# Vivado block design design_1, xczu28dr-ffvg1517-2-e, Vivado 2021.1
# (continued, part 4 of 9)
current_bd_instance /chan4/GPIO

create_bd_cell -type ip -vlnv xilinx.com:ip:xlslice:1.0 xlslice_mix_dp
set_property -dict {CONFIG.DIN_FROM 21 CONFIG.DIN_TO 0 CONFIG.DOUT_WIDTH 22} [get_bd_cells xlslice_mix_dp]
create_bd_cell -type ip -vlnv xilinx.com:ip:xlslice:1.0 xlslice_beat_we0
set_property -dict {CONFIG.DIN_FROM 0 CONFIG.DIN_TO 0 CONFIG.DOUT_WIDTH 1} [get_bd_cells xlslice_beat_we0]
create_bd_cell -type ip -vlnv xilinx.com:ip:xlslice:1.0 we_odd_9
set_property -dict {CONFIG.DIN_FROM 11 CONFIG.DIN_TO 0 CONFIG.DOUT_WIDTH 12} [get_bd_cells we_odd_9]
create_bd_cell -type ip -vlnv xilinx.com:ip:xlslice:1.0 we_even_1
set_property -dict {CONFIG.DIN_FROM 0 CONFIG.DOUT_WIDTH 1} [get_bd_cells we_even_1]
create_bd_cell -type ip -vlnv xilinx.com:ip:axi_gpio:2.0 axi_gpio_6
set_property -dict {CONFIG.C_ALL_OUTPUTS 1 CONFIG.C_ALL_OUTPUTS_2 1 CONFIG.C_IS_DUAL 1} [get_bd_cells axi_gpio_6]
create_bd_cell -type ip -vlnv xilinx.com:ip:xlslice:1.0 xlslice_getAccumChan
set_property -dict {CONFIG.DIN_FROM 31 CONFIG.DIN_TO 23 CONFIG.DOUT_WIDTH 9} [get_bd_cells xlslice_getAccumChan]
create_bd_cell -type ip -vlnv xilinx.com:ip:axi_gpio:2.0 axi_gpio_7
set_property -dict {CONFIG.C_ALL_OUTPUTS 1 CONFIG.C_ALL_OUTPUTS_2 1 CONFIG.C_IS_DUAL 1} [get_bd_cells axi_gpio_7]
create_bd_cell -type ip -vlnv xilinx.com:ip:xlslice:1.0 we_even_2
set_property -dict {CONFIG.DIN_FROM 1 CONFIG.DIN_TO 1 CONFIG.DOUT_WIDTH 1} [get_bd_cells we_even_2]
create_bd_cell -type ip -vlnv xilinx.com:ip:xlslice:1.0 xlslice_beat_we1
set_property -dict {CONFIG.DIN_FROM 1 CONFIG.DIN_TO 1 CONFIG.DOUT_WIDTH 1} [get_bd_cells xlslice_beat_we1]
create_bd_cell -type ip -vlnv xilinx.com:ip:xlslice:1.0 xlslice_fft_scale
set_property -dict {CONFIG.DIN_FROM 10 CONFIG.DIN_TO 0 CONFIG.DOUT_WIDTH 11} [get_bd_cells xlslice_fft_scale]
create_bd_cell -type ip -vlnv xilinx.com:ip:xlslice:1.0 xlslice_beat_we2
set_property -dict {CONFIG.DIN_FROM 2 CONFIG.DIN_TO 2 CONFIG.DOUT_WIDTH 1} [get_bd_cells xlslice_beat_we2]
create_bd_cell -type ip -vlnv xilinx.com:ip:xlslice:1.0 we_even_3
set_property -dict {CONFIG.DIN_FROM 2 CONFIG.DIN_TO 2 CONFIG.DOUT_WIDTH 1} [get_bd_cells we_even_3]
create_bd_cell -type ip -vlnv xilinx.com:ip:axi_gpio:2.0 axi_gpio_8
set_property -dict {CONFIG.C_ALL_OUTPUTS 1 CONFIG.C_ALL_OUTPUTS_2 1 CONFIG.C_IS_DUAL 1} [get_bd_cells axi_gpio_8]
create_bd_cell -type ip -vlnv xilinx.com:ip:xlslice:1.0 xlslice_0
set_property -dict {CONFIG.DIN_FROM 17 CONFIG.DOUT_WIDTH 18} [get_bd_cells xlslice_0]
create_bd_cell -type ip -vlnv xilinx.com:ip:xlslice:1.0 start
create_bd_cell -type ip -vlnv xilinx.com:ip:axi_gpio:2.0 axi_gpio_9
set_property -dict {CONFIG.C_ALL_OUTPUTS 1 CONFIG.C_ALL_OUTPUTS_2 1 CONFIG.C_IS_DUAL 1} [get_bd_cells axi_gpio_9]
create_bd_cell -type ip -vlnv xilinx.com:ip:xlslice:1.0 we_even_4
set_property -dict {CONFIG.DIN_FROM 3 CONFIG.DIN_TO 3 CONFIG.DOUT_WIDTH 1} [get_bd_cells we_even_4]
create_bd_cell -type ip -vlnv xilinx.com:ip:xlslice:1.0 xlslice_beat_we3
set_property -dict {CONFIG.DIN_FROM 3 CONFIG.DIN_TO 3 CONFIG.DOUT_WIDTH 1} [get_bd_cells xlslice_beat_we3]
create_bd_cell -type ip -vlnv xilinx.com:ip:xlslice:1.0 xlslice_1
set_property -dict {CONFIG.DIN_FROM 17 CONFIG.DOUT_WIDTH 18} [get_bd_cells xlslice_1]
create_bd_cell -type ip -vlnv xilinx.com:ip:xlslice:1.0 we_odd_10
set_property -dict {CONFIG.DIN_FROM 23 CONFIG.DIN_TO 12 CONFIG.DOUT_WIDTH 12} [get_bd_cells we_odd_10]
create_bd_cell -type ip -vlnv xilinx.com:ip:xlslice:1.0 xlslice_beat_addr
set_property -dict {CONFIG.DIN_FROM 28 CONFIG.DIN_TO 20 CONFIG.DOUT_WIDTH 9} [get_bd_cells xlslice_beat_addr]
create_bd_cell -type ip -vlnv xilinx.com:ip:xlslice:1.0 xlslice_bin_sel_we
set_property -dict {CONFIG.DIN_FROM 0 CONFIG.DIN_TO 0 CONFIG.DOUT_WIDTH 1} [get_bd_cells xlslice_bin_sel_we]
create_bd_cell -type ip -vlnv xilinx.com:ip:xlslice:1.0 we_odd_11
set_property -dict {CONFIG.DIN_FROM 11 CONFIG.DIN_TO 0 CONFIG.DOUT_WIDTH 12} [get_bd_cells we_odd_11]
create_bd_cell -type ip -vlnv xilinx.com:ip:xlslice:1.0 we_odd_1
set_property -dict {CONFIG.DIN_FROM 4 CONFIG.DIN_TO 4 CONFIG.DOUT_WIDTH 1} [get_bd_cells we_odd_1]
create_bd_cell -type ip -vlnv xilinx.com:ip:xlslice:1.0 xlslice_getAccum_rst
set_property -dict {CONFIG.DIN_FROM 1 CONFIG.DIN_TO 1 CONFIG.DOUT_WIDTH 1} [get_bd_cells xlslice_getAccum_rst]
create_bd_cell -type ip -vlnv xilinx.com:ip:xlslice:1.0 xlslice_beat_dphi
set_property -dict {CONFIG.DIN_FROM 19 CONFIG.DIN_TO 4 CONFIG.DOUT_WIDTH 16} [get_bd_cells xlslice_beat_dphi]
create_bd_cell -type ip -vlnv xilinx.com:ip:xlslice:1.0 xlslice_3
set_property -dict {CONFIG.DIN_FROM 23 CONFIG.DIN_TO 16 CONFIG.DOUT_WIDTH 8} [get_bd_cells xlslice_3]
create_bd_cell -type ip -vlnv xilinx.com:ip:xlslice:1.0 we_odd_2
set_property -dict {CONFIG.DIN_FROM 5 CONFIG.DIN_TO 5 CONFIG.DOUT_WIDTH 1} [get_bd_cells we_odd_2]
create_bd_cell -type ip -vlnv xilinx.com:ip:xlslice:1.0 we_odd_12
set_property -dict {CONFIG.DIN_FROM 23 CONFIG.DIN_TO 12 CONFIG.DOUT_WIDTH 12} [get_bd_cells we_odd_12]
create_bd_cell -type ip -vlnv xilinx.com:ip:xlslice:1.0 we_odd_13
set_property -dict {CONFIG.DIN_FROM 11 CONFIG.DIN_TO 0 CONFIG.DOUT_WIDTH 12} [get_bd_cells we_odd_13]
create_bd_cell -type ip -vlnv xilinx.com:ip:xlslice:1.0 we_odd_3
set_property -dict {CONFIG.DIN_FROM 6 CONFIG.DIN_TO 6 CONFIG.DOUT_WIDTH 1} [get_bd_cells we_odd_3]
create_bd_cell -type ip -vlnv xilinx.com:ip:axi_gpio:2.0 axi_gpio_0
set_property -dict [list \
  CONFIG.C_ALL_OUTPUTS 1 \
  CONFIG.C_IS_DUAL 0 \
  CONFIG.GPIO2_BOARD_INTERFACE Custom \
  CONFIG.USE_BOARD_FLOW true \
] [get_bd_cells axi_gpio_0]
create_bd_cell -type ip -vlnv xilinx.com:ip:xlslice:1.0 xlslice_4
set_property -dict {CONFIG.DIN_FROM 15 CONFIG.DOUT_WIDTH 16} [get_bd_cells xlslice_4]
create_bd_cell -type ip -vlnv xilinx.com:ip:axi_gpio:2.0 axi_gpio_1
set_property -dict {CONFIG.C_ALL_OUTPUTS 1 CONFIG.C_ALL_OUTPUTS_2 1 CONFIG.C_IS_DUAL 1} [get_bd_cells axi_gpio_1]
create_bd_cell -type ip -vlnv xilinx.com:ip:xlslice:1.0 we_odd_4
set_property -dict {CONFIG.DIN_FROM 7 CONFIG.DIN_TO 7 CONFIG.DOUT_WIDTH 1} [get_bd_cells we_odd_4]
create_bd_cell -type ip -vlnv xilinx.com:ip:xlslice:1.0 we_odd_14
set_property -dict {CONFIG.DIN_FROM 23 CONFIG.DIN_TO 12 CONFIG.DOUT_WIDTH 12} [get_bd_cells we_odd_14]
create_bd_cell -type ip -vlnv xilinx.com:ip:xlslice:1.0 we_odd_5
set_property -dict {CONFIG.DIN_FROM 0 CONFIG.DIN_TO 0 CONFIG.DOUT_WIDTH 1} [get_bd_cells we_odd_5]
create_bd_cell -type ip -vlnv xilinx.com:ip:axi_gpio:2.0 axi_gpio_2
set_property -dict {CONFIG.C_ALL_OUTPUTS 1 CONFIG.C_ALL_OUTPUTS_2 1 CONFIG.C_IS_DUAL 1} [get_bd_cells axi_gpio_2]
create_bd_cell -type ip -vlnv xilinx.com:ip:xlslice:1.0 xlslice_bin_sel_addr
set_property -dict {CONFIG.DIN_FROM 9 CONFIG.DIN_TO 0 CONFIG.DOUT_WIDTH 10} [get_bd_cells xlslice_bin_sel_addr]
create_bd_cell -type ip -vlnv xilinx.com:ip:axi_gpio:2.0 axi_gpio_3
set_property -dict {CONFIG.C_ALL_OUTPUTS 1 CONFIG.C_ALL_OUTPUTS_2 1 CONFIG.C_IS_DUAL 1} [get_bd_cells axi_gpio_3]
create_bd_cell -type ip -vlnv xilinx.com:ip:xlslice:1.0 reset
set_property -dict {CONFIG.DIN_FROM 1 CONFIG.DIN_TO 1 CONFIG.DOUT_WIDTH 1} [get_bd_cells reset]
create_bd_cell -type ip -vlnv xilinx.com:ip:xlslice:1.0 we_odd_6
set_property -dict {CONFIG.DIN_FROM 7 CONFIG.DIN_TO 0 CONFIG.DOUT_WIDTH 8} [get_bd_cells we_odd_6]
create_bd_cell -type ip -vlnv xilinx.com:ip:xlslice:1.0 xlslice_bin_sel_data0
set_property -dict {CONFIG.DIN_FROM 31 CONFIG.DIN_TO 10 CONFIG.DOUT_WIDTH 22} [get_bd_cells xlslice_bin_sel_data0]
create_bd_cell -type ip -vlnv xilinx.com:ip:xlslice:1.0 we_odd_7
set_property -dict {CONFIG.DIN_FROM 11 CONFIG.DIN_TO 0 CONFIG.DOUT_WIDTH 12} [get_bd_cells we_odd_7]
create_bd_cell -type ip -vlnv xilinx.com:ip:axi_gpio:2.0 axi_gpio_4
set_property -dict {CONFIG.C_ALL_OUTPUTS 1 CONFIG.C_ALL_OUTPUTS_2 1 CONFIG.C_IS_DUAL 1} [get_bd_cells axi_gpio_4]
create_bd_cell -type ip -vlnv xilinx.com:ip:axi_gpio:2.0 axi_gpio_10
set_property -dict {CONFIG.C_ALL_OUTPUTS 1 CONFIG.C_IS_DUAL 0} [get_bd_cells axi_gpio_10]
create_bd_cell -type ip -vlnv xilinx.com:ip:xlslice:1.0 xlslice_acc_length
set_property -dict {CONFIG.DIN_FROM 22 CONFIG.DIN_TO 0 CONFIG.DOUT_WIDTH 23} [get_bd_cells xlslice_acc_length]
create_bd_cell -type ip -vlnv xilinx.com:ip:xlslice:1.0 we_odd_8
set_property -dict {CONFIG.DIN_FROM 23 CONFIG.DIN_TO 12 CONFIG.DOUT_WIDTH 12} [get_bd_cells we_odd_8]
create_bd_cell -type ip -vlnv xilinx.com:ip:xlslice:1.0 xlslice_bin_sel_data1
set_property -dict {CONFIG.DIN_FROM 22 CONFIG.DIN_TO 1 CONFIG.DOUT_WIDTH 22} [get_bd_cells xlslice_bin_sel_data1]
create_bd_cell -type ip -vlnv xilinx.com:ip:xlslice:1.0 xlslice_bramx32v2_start
set_property -dict {CONFIG.DIN_FROM 0 CONFIG.DIN_TO 0 CONFIG.DOUT_WIDTH 1} [get_bd_cells xlslice_bramx32v2_start]
create_bd_cell -type ip -vlnv xilinx.com:ip:axi_gpio:2.0 axi_gpio_5
set_property -dict [list \
  CONFIG.C_ALL_INPUTS 0 \
  CONFIG.C_ALL_INPUTS_2 1 \
  CONFIG.C_ALL_OUTPUTS 1 \
  CONFIG.C_IS_DUAL 1 \
] [get_bd_cells axi_gpio_5]
create_bd_cell -type ip -vlnv xilinx.com:ip:xlslice:1.0 xlslice_PSBscaleC
set_property -dict {CONFIG.DIN_FROM 15 CONFIG.DIN_TO 0 CONFIG.DOUT_WIDTH 16} [get_bd_cells xlslice_PSBscaleC]

# ---- hierarchy /chan4/psb_out_post ----
current_bd_instance /chan4/psb_out_post
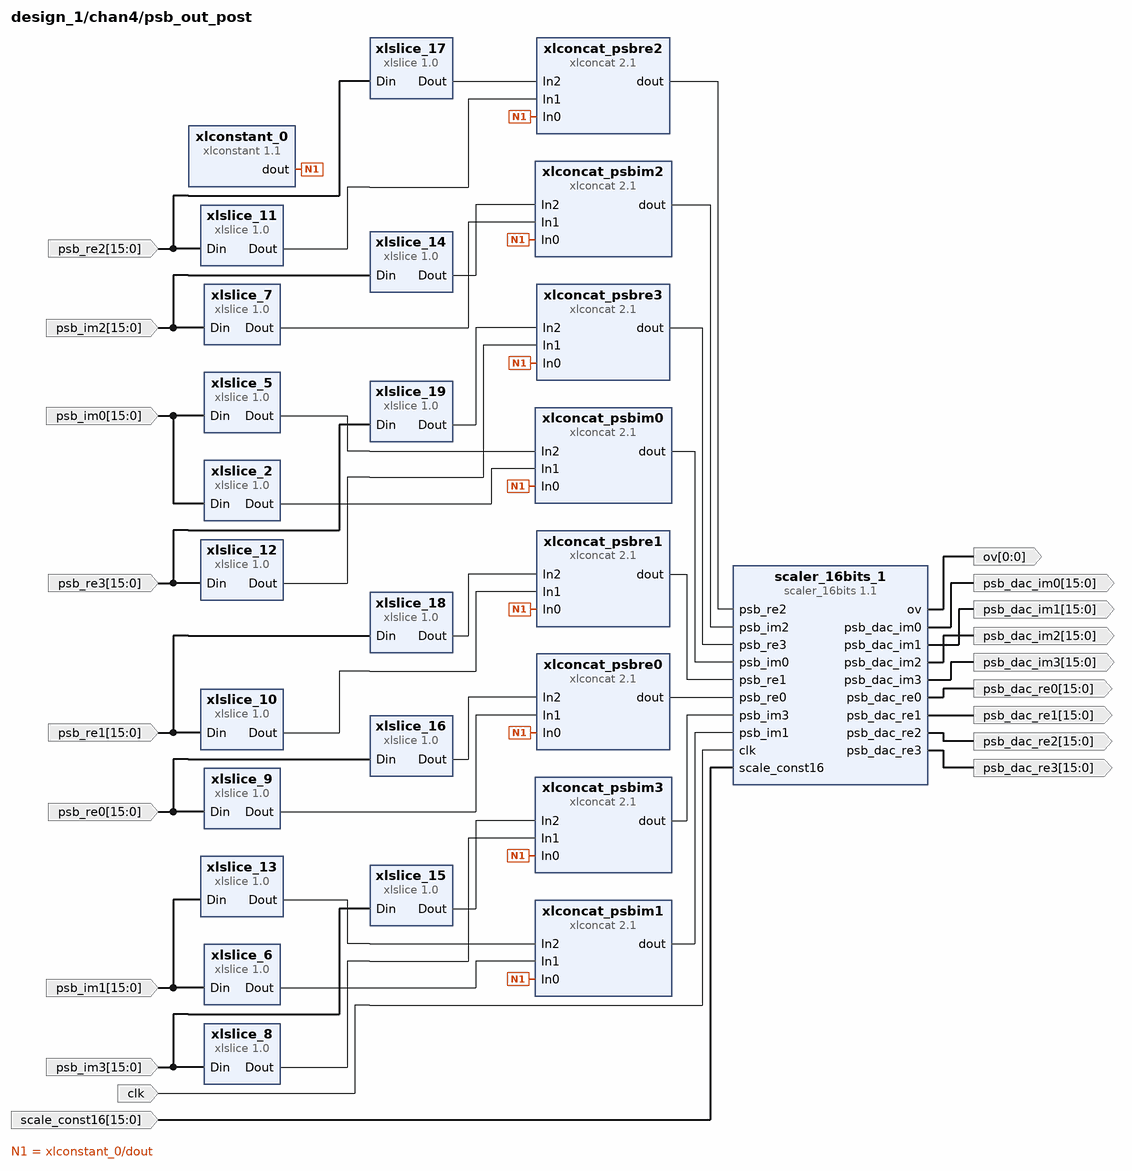
[diagram p26: block diagram inside /chan4/psb_out_post]
create_bd_pin -dir I -from 15 -to 0 psb_im0
create_bd_pin -dir I -from 15 -to 0 psb_im1
create_bd_pin -dir I -from 15 -to 0 psb_im2
create_bd_pin -dir I -from 15 -to 0 psb_im3
create_bd_pin -dir I -from 15 -to 0 psb_re0
create_bd_pin -dir I -from 15 -to 0 psb_re1
create_bd_pin -dir I -from 15 -to 0 psb_re2
create_bd_pin -dir I -from 15 -to 0 psb_re3
create_bd_pin -dir I -from 15 -to 0 scale_const16
create_bd_pin -dir I -type clk clk
create_bd_pin -dir O -from 15 -to 0 psb_dac_im0
create_bd_pin -dir O -from 15 -to 0 psb_dac_im1
create_bd_pin -dir O -from 15 -to 0 psb_dac_im2
create_bd_pin -dir O -from 15 -to 0 psb_dac_im3
create_bd_pin -dir O -from 15 -to 0 psb_dac_re0
create_bd_pin -dir O -from 15 -to 0 psb_dac_re1
create_bd_pin -dir O -from 15 -to 0 psb_dac_re2
create_bd_pin -dir O -from 15 -to 0 psb_dac_re3
create_bd_pin -dir O -from 0 -to 0 ov

create_bd_cell -type ip -vlnv xilinx.com:ip:xlslice:1.0 xlslice_10
set_property -dict {CONFIG.DIN_FROM 13 CONFIG.DIN_WIDTH 16 CONFIG.DOUT_WIDTH 14} [get_bd_cells xlslice_10]
create_bd_cell -type ip -vlnv xilinx.com:ip:xlconstant:1.1 xlconstant_0
set_property -dict {CONFIG.CONST_VAL 0} [get_bd_cells xlconstant_0]
create_bd_cell -type ip -vlnv xilinx.com:ip:xlslice:1.0 xlslice_11
set_property -dict {CONFIG.DIN_FROM 13 CONFIG.DIN_WIDTH 16 CONFIG.DOUT_WIDTH 14} [get_bd_cells xlslice_11]
create_bd_cell -type ip -vlnv xilinx.com:ip:xlslice:1.0 xlslice_2
set_property -dict {CONFIG.DIN_FROM 13 CONFIG.DIN_WIDTH 16 CONFIG.DOUT_WIDTH 14} [get_bd_cells xlslice_2]
create_bd_cell -type ip -vlnv xilinx.com:ip:xlslice:1.0 xlslice_12
set_property -dict {CONFIG.DIN_FROM 13 CONFIG.DIN_WIDTH 16 CONFIG.DOUT_WIDTH 14} [get_bd_cells xlslice_12]
create_bd_cell -type ip -vlnv xilinx.com:ip:xlslice:1.0 xlslice_13
set_property -dict {CONFIG.DIN_FROM 15 CONFIG.DIN_TO 15 CONFIG.DIN_WIDTH 16 CONFIG.DOUT_WIDTH 1} [get_bd_cells xlslice_13]
create_bd_cell -type ip -vlnv xilinx.com:ip:xlslice:1.0 xlslice_14
set_property -dict {CONFIG.DIN_FROM 15 CONFIG.DIN_TO 15 CONFIG.DIN_WIDTH 16 CONFIG.DOUT_WIDTH 1} [get_bd_cells xlslice_14]
create_bd_cell -type ip -vlnv xilinx.com:ip:xlconcat:2.1 xlconcat_psbim0
set_property -dict [list \
  CONFIG.IN0_WIDTH 1 \
  CONFIG.IN1_WIDTH 14 \
  CONFIG.IN2_WIDTH 1 \
  CONFIG.IN3_WIDTH 16 \
  CONFIG.IN4_WIDTH 16 \
  CONFIG.IN5_WIDTH 16 \
  CONFIG.IN6_WIDTH 16 \
  CONFIG.IN7_WIDTH 16 \
  CONFIG.NUM_PORTS 3 \
] [get_bd_cells xlconcat_psbim0]
create_bd_cell -type ip -vlnv xilinx.com:ip:xlconcat:2.1 xlconcat_psbim1
set_property -dict [list \
  CONFIG.IN0_WIDTH 1 \
  CONFIG.IN1_WIDTH 14 \
  CONFIG.IN2_WIDTH 1 \
  CONFIG.IN3_WIDTH 16 \
  CONFIG.IN4_WIDTH 16 \
  CONFIG.IN5_WIDTH 16 \
  CONFIG.IN6_WIDTH 16 \
  CONFIG.IN7_WIDTH 16 \
  CONFIG.NUM_PORTS 3 \
] [get_bd_cells xlconcat_psbim1]
create_bd_cell -type ip -vlnv xilinx.com:ip:xlconcat:2.1 xlconcat_psbre0
set_property -dict [list \
  CONFIG.IN0_WIDTH 1 \
  CONFIG.IN1_WIDTH 14 \
  CONFIG.IN2_WIDTH 1 \
  CONFIG.IN3_WIDTH 16 \
  CONFIG.IN4_WIDTH 16 \
  CONFIG.IN5_WIDTH 16 \
  CONFIG.IN6_WIDTH 16 \
  CONFIG.IN7_WIDTH 16 \
  CONFIG.NUM_PORTS 3 \
] [get_bd_cells xlconcat_psbre0]
create_bd_cell -type ip -vlnv xilinx.com:ip:xlslice:1.0 xlslice_15
set_property -dict {CONFIG.DIN_FROM 15 CONFIG.DIN_TO 15 CONFIG.DIN_WIDTH 16 CONFIG.DOUT_WIDTH 1} [get_bd_cells xlslice_15]
create_bd_cell -type ip -vlnv xilinx.com:ip:xlslice:1.0 xlslice_5
set_property -dict {CONFIG.DIN_FROM 15 CONFIG.DIN_TO 15 CONFIG.DIN_WIDTH 16 CONFIG.DOUT_WIDTH 1} [get_bd_cells xlslice_5]
create_bd_cell -type ip -vlnv xilinx.com:ip:xlconcat:2.1 xlconcat_psbim2
set_property -dict [list \
  CONFIG.IN0_WIDTH 1 \
  CONFIG.IN1_WIDTH 14 \
  CONFIG.IN2_WIDTH 1 \
  CONFIG.IN3_WIDTH 16 \
  CONFIG.IN4_WIDTH 16 \
  CONFIG.IN5_WIDTH 16 \
  CONFIG.IN6_WIDTH 16 \
  CONFIG.IN7_WIDTH 16 \
  CONFIG.NUM_PORTS 3 \
] [get_bd_cells xlconcat_psbim2]
create_bd_cell -type ip -vlnv xilinx.com:ip:xlslice:1.0 xlslice_16
set_property -dict {CONFIG.DIN_FROM 15 CONFIG.DIN_TO 15 CONFIG.DIN_WIDTH 16 CONFIG.DOUT_WIDTH 1} [get_bd_cells xlslice_16]
create_bd_cell -type ip -vlnv xilinx.com:ip:xlslice:1.0 xlslice_6
set_property -dict {CONFIG.DIN_FROM 13 CONFIG.DIN_WIDTH 16 CONFIG.DOUT_WIDTH 14} [get_bd_cells xlslice_6]
create_bd_cell -type ip -vlnv xilinx.com:ip:xlconcat:2.1 xlconcat_psbre1
set_property -dict [list \
  CONFIG.IN0_WIDTH 1 \
  CONFIG.IN1_WIDTH 14 \
  CONFIG.IN2_WIDTH 1 \
  CONFIG.IN3_WIDTH 16 \
  CONFIG.IN4_WIDTH 16 \
  CONFIG.IN5_WIDTH 16 \
  CONFIG.IN6_WIDTH 16 \
  CONFIG.IN7_WIDTH 16 \
  CONFIG.NUM_PORTS 3 \
] [get_bd_cells xlconcat_psbre1]
create_bd_cell -type ip -vlnv xilinx.com:ip:xlconcat:2.1 xlconcat_psbre2
set_property -dict [list \
  CONFIG.IN0_WIDTH 1 \
  CONFIG.IN1_WIDTH 14 \
  CONFIG.IN2_WIDTH 1 \
  CONFIG.IN3_WIDTH 16 \
  CONFIG.IN4_WIDTH 16 \
  CONFIG.IN5_WIDTH 16 \
  CONFIG.IN6_WIDTH 16 \
  CONFIG.IN7_WIDTH 16 \
  CONFIG.NUM_PORTS 3 \
] [get_bd_cells xlconcat_psbre2]
create_bd_cell -type ip -vlnv xilinx.com:ip:xlslice:1.0 xlslice_17
set_property -dict {CONFIG.DIN_FROM 15 CONFIG.DIN_TO 15 CONFIG.DIN_WIDTH 16 CONFIG.DOUT_WIDTH 1} [get_bd_cells xlslice_17]
create_bd_cell -type ip -vlnv xilinx.com:ip:xlslice:1.0 xlslice_7
set_property -dict {CONFIG.DIN_FROM 13 CONFIG.DIN_WIDTH 16 CONFIG.DOUT_WIDTH 14} [get_bd_cells xlslice_7]
create_bd_cell -type ip -vlnv xilinx.com:ip:xlconcat:2.1 xlconcat_psbim3
set_property -dict [list \
  CONFIG.IN0_WIDTH 1 \
  CONFIG.IN1_WIDTH 14 \
  CONFIG.IN2_WIDTH 1 \
  CONFIG.IN3_WIDTH 16 \
  CONFIG.IN4_WIDTH 16 \
  CONFIG.IN5_WIDTH 16 \
  CONFIG.IN6_WIDTH 16 \
  CONFIG.IN7_WIDTH 16 \
  CONFIG.NUM_PORTS 3 \
] [get_bd_cells xlconcat_psbim3]
create_bd_cell -type ip -vlnv xilinx.com:ip:xlslice:1.0 xlslice_18
set_property -dict {CONFIG.DIN_FROM 15 CONFIG.DIN_TO 15 CONFIG.DIN_WIDTH 16 CONFIG.DOUT_WIDTH 1} [get_bd_cells xlslice_18]
create_bd_cell -type ip -vlnv xilinx.com:ip:xlslice:1.0 xlslice_8
set_property -dict {CONFIG.DIN_FROM 13 CONFIG.DIN_WIDTH 16 CONFIG.DOUT_WIDTH 14} [get_bd_cells xlslice_8]
create_bd_cell -type ip -vlnv xilinx.com:ip:xlconcat:2.1 xlconcat_psbre3
set_property -dict [list \
  CONFIG.IN0_WIDTH 1 \
  CONFIG.IN1_WIDTH 14 \
  CONFIG.IN2_WIDTH 1 \
  CONFIG.IN3_WIDTH 16 \
  CONFIG.IN4_WIDTH 16 \
  CONFIG.IN5_WIDTH 16 \
  CONFIG.IN6_WIDTH 16 \
  CONFIG.IN7_WIDTH 16 \
  CONFIG.NUM_PORTS 3 \
] [get_bd_cells xlconcat_psbre3]
create_bd_cell -type ip -vlnv xilinx.com:ip:xlslice:1.0 xlslice_19
set_property -dict {CONFIG.DIN_FROM 15 CONFIG.DIN_TO 15 CONFIG.DIN_WIDTH 16 CONFIG.DOUT_WIDTH 1} [get_bd_cells xlslice_19]
create_bd_cell -type ip -vlnv xilinx.com:ip:xlslice:1.0 xlslice_9
set_property -dict {CONFIG.DIN_FROM 13 CONFIG.DIN_WIDTH 16 CONFIG.DOUT_WIDTH 14} [get_bd_cells xlslice_9]
create_bd_cell -type ip -vlnv xilinx.com:user:scaler_16bits:1.1 scaler_16bits_1

# ---- hierarchy /chan4/fine_nco ----
current_bd_instance /chan4/fine_nco
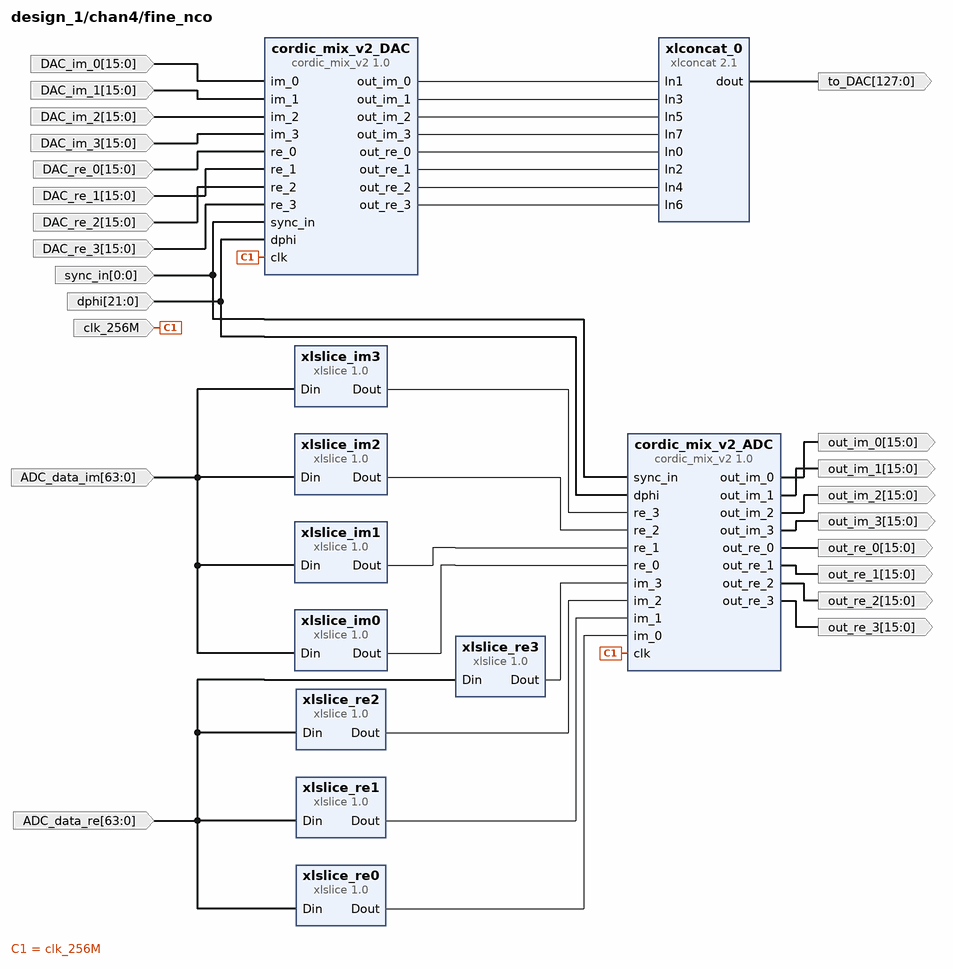
[diagram p27: block diagram inside /chan4/fine_nco]
create_bd_pin -dir I -from 63 -to 0 ADC_data_im
create_bd_pin -dir O -from 127 -to 0 to_DAC
create_bd_pin -dir I -from 63 -to 0 ADC_data_re
create_bd_pin -dir I -from 21 -to 0 dphi
create_bd_pin -dir I -from 0 -to 0 sync_in
create_bd_pin -dir I -type clk clk_256M
create_bd_pin -dir O -from 15 -to 0 out_im_0
create_bd_pin -dir O -from 15 -to 0 out_im_1
create_bd_pin -dir O -from 15 -to 0 out_im_2
create_bd_pin -dir O -from 15 -to 0 out_im_3
create_bd_pin -dir O -from 15 -to 0 out_re_0
create_bd_pin -dir O -from 15 -to 0 out_re_1
create_bd_pin -dir O -from 15 -to 0 out_re_2
create_bd_pin -dir O -from 15 -to 0 out_re_3
create_bd_pin -dir I -from 15 -to 0 DAC_im_0
create_bd_pin -dir I -from 15 -to 0 DAC_im_1
create_bd_pin -dir I -from 15 -to 0 DAC_im_2
create_bd_pin -dir I -from 15 -to 0 DAC_im_3
create_bd_pin -dir I -from 15 -to 0 DAC_re_0
create_bd_pin -dir I -from 15 -to 0 DAC_re_1
create_bd_pin -dir I -from 15 -to 0 DAC_re_2
create_bd_pin -dir I -from 15 -to 0 DAC_re_3

create_bd_cell -type ip -vlnv xilinx.com:ip:xlslice:1.0 xlslice_im0
set_property -dict {CONFIG.DIN_FROM 15 CONFIG.DIN_TO 0 CONFIG.DIN_WIDTH 64 CONFIG.DOUT_WIDTH 16} [get_bd_cells xlslice_im0]
create_bd_cell -type ip -vlnv xilinx.com:ip:xlslice:1.0 xlslice_im1
set_property -dict {CONFIG.DIN_FROM 31 CONFIG.DIN_TO 16 CONFIG.DIN_WIDTH 64 CONFIG.DOUT_WIDTH 16} [get_bd_cells xlslice_im1]
create_bd_cell -type ip -vlnv xilinx.com:ip:xlslice:1.0 xlslice_im2
set_property -dict {CONFIG.DIN_FROM 47 CONFIG.DIN_TO 32 CONFIG.DIN_WIDTH 64 CONFIG.DOUT_WIDTH 16} [get_bd_cells xlslice_im2]
create_bd_cell -type ip -vlnv xilinx.com:ip:xlconcat:2.1 xlconcat_0
set_property -dict [list \
  CONFIG.IN2_WIDTH 16 \
  CONFIG.IN3_WIDTH 16 \
  CONFIG.IN4_WIDTH 16 \
  CONFIG.IN5_WIDTH 16 \
  CONFIG.IN6_WIDTH 16 \
  CONFIG.IN7_WIDTH 16 \
  CONFIG.NUM_PORTS 8 \
] [get_bd_cells xlconcat_0]
create_bd_cell -type ip -vlnv xilinx.com:ip:xlslice:1.0 xlslice_re0
set_property -dict {CONFIG.DIN_FROM 15 CONFIG.DIN_TO 0 CONFIG.DIN_WIDTH 64 CONFIG.DOUT_WIDTH 16} [get_bd_cells xlslice_re0]
create_bd_cell -type ip -vlnv xilinx.com:ip:xlslice:1.0 xlslice_im3
set_property -dict {CONFIG.DIN_FROM 63 CONFIG.DIN_TO 48 CONFIG.DIN_WIDTH 64 CONFIG.DOUT_WIDTH 16} [get_bd_cells xlslice_im3]
create_bd_cell -type ip -vlnv xilinx.com:ip:xlslice:1.0 xlslice_re1
set_property -dict {CONFIG.DIN_FROM 31 CONFIG.DIN_TO 16 CONFIG.DIN_WIDTH 64 CONFIG.DOUT_WIDTH 16} [get_bd_cells xlslice_re1]
create_bd_cell -type ip -vlnv xilinx.com:ip:xlslice:1.0 xlslice_re2
set_property -dict {CONFIG.DIN_FROM 47 CONFIG.DIN_TO 32 CONFIG.DIN_WIDTH 64 CONFIG.DOUT_WIDTH 16} [get_bd_cells xlslice_re2]
create_bd_cell -type ip -vlnv xilinx.com:user:cordic_mix_v2:1.0 cordic_mix_v2_ADC
create_bd_cell -type ip -vlnv xilinx.com:user:cordic_mix_v2:1.0 cordic_mix_v2_DAC
create_bd_cell -type ip -vlnv xilinx.com:ip:xlslice:1.0 xlslice_re3
set_property -dict {CONFIG.DIN_FROM 63 CONFIG.DIN_TO 48 CONFIG.DIN_WIDTH 64 CONFIG.DOUT_WIDTH 16} [get_bd_cells xlslice_re3]

# ---- hierarchy /ethWrapPort1 ----
current_bd_instance /ethWrapPort1
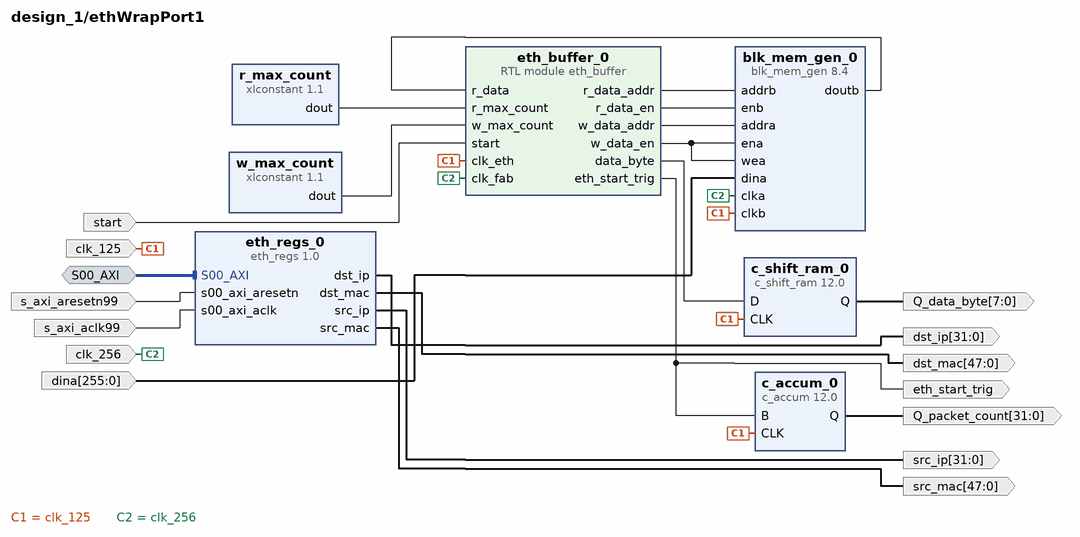
[diagram p28: block diagram inside /ethWrapPort1]
create_bd_intf_pin -mode Slave -vlnv xilinx.com:interface:aximm_rtl:1.0 S00_AXI
create_bd_pin -dir I start
create_bd_pin -dir I -type clk clk_256
create_bd_pin -dir I -type clk clk_125
create_bd_pin -dir I -type rst s_axi_aresetn99
create_bd_pin -dir O eth_start_trig
create_bd_pin -dir O -from 31 -to 0 src_ip
create_bd_pin -dir O -from 47 -to 0 src_mac
create_bd_pin -dir O -from 31 -to 0 dst_ip
create_bd_pin -dir O -from 47 -to 0 dst_mac
create_bd_pin -dir O -from 7 -to 0 -type data Q_data_byte
create_bd_pin -dir O -from 31 -to 0 -type data Q_packet_count
create_bd_pin -dir I s_axi_aclk99
create_bd_pin -dir I -from 255 -to 0 dina

create_bd_cell -type ip -vlnv xilinx.com:ip:xlconstant:1.1 w_max_count
set_property -dict {CONFIG.CONST_VAL 512 CONFIG.CONST_WIDTH 10} [get_bd_cells w_max_count]
create_bd_cell -type ip -vlnv xilinx.com:ip:blk_mem_gen:8.4 blk_mem_gen_0
set_property -dict [list \
  CONFIG.Enable_32bit_Address false \
  CONFIG.Enable_B Use_ENB_Pin \
  CONFIG.Memory_Type Simple_Dual_Port_RAM \
  CONFIG.Operating_Mode_A NO_CHANGE \
  CONFIG.Port_B_Clock 100 \
  CONFIG.Port_B_Enable_Rate 100 \
  CONFIG.Read_Width_B 256 \
  CONFIG.Register_PortB_Output_of_Memory_Primitives true \
  CONFIG.Use_Byte_Write_Enable false \
  CONFIG.Write_Depth_A 1024 \
  CONFIG.Write_Width_A 256 \
  CONFIG.Write_Width_B 256 \
  CONFIG.use_bram_block Stand_Alone \
] [get_bd_cells blk_mem_gen_0]
create_bd_cell -type ip -vlnv xilinx.com:ip:xlconstant:1.1 r_max_count
set_property -dict {CONFIG.CONST_VAL 16383 CONFIG.CONST_WIDTH 15} [get_bd_cells r_max_count]
create_bd_cell -type ip -vlnv xilinx.com:ip:c_shift_ram:12.0 c_shift_ram_0
set_property -dict [list \
  CONFIG.AsyncInitVal 00000000 \
  CONFIG.DefaultData 00000000 \
  CONFIG.Depth 42 \
  CONFIG.Width 8 \
] [get_bd_cells c_shift_ram_0]
create_bd_cell -type ip -vlnv xilinx.com:ip:c_accum:12.0 c_accum_0
set_property -dict [list \
  CONFIG.Bypass false \
  CONFIG.Input_Type Unsigned \
  CONFIG.Input_Width 1 \
  CONFIG.Output_Width 32 \
] [get_bd_cells c_accum_0]
create_bd_cell -type ip -vlnv user.org:user:eth_regs:1.0 eth_regs_0
create_bd_cell -type module -reference eth_buffer eth_buffer_0

# ---- hierarchy /ethWrapPort2 ----
current_bd_instance /ethWrapPort2
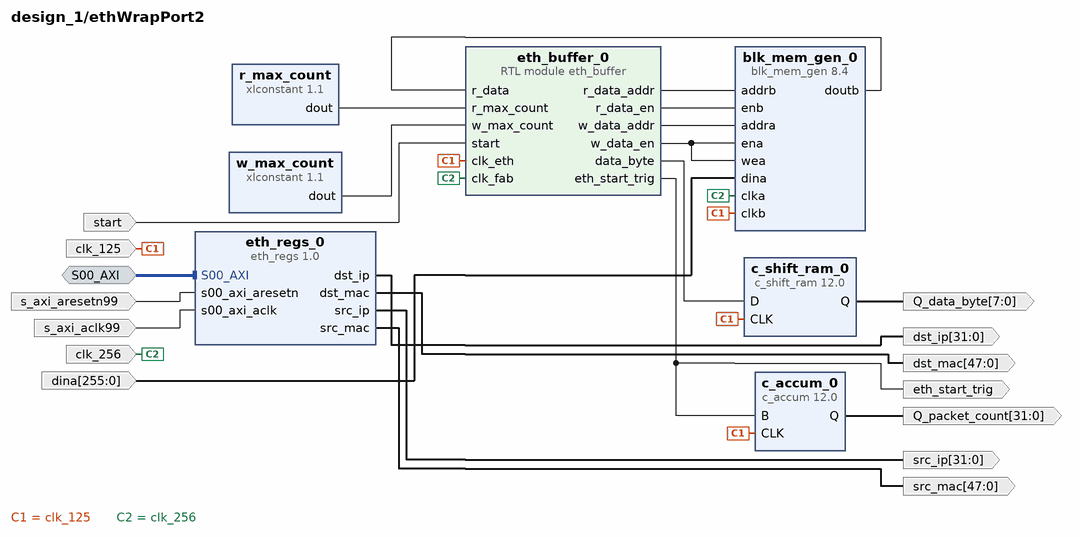
[diagram p29: block diagram inside /ethWrapPort2]
create_bd_intf_pin -mode Slave -vlnv xilinx.com:interface:aximm_rtl:1.0 S00_AXI
create_bd_pin -dir I start
create_bd_pin -dir I -type clk clk_256
create_bd_pin -dir I -type clk clk_125
create_bd_pin -dir I -type rst s_axi_aresetn99
create_bd_pin -dir O eth_start_trig
create_bd_pin -dir O -from 31 -to 0 src_ip
create_bd_pin -dir O -from 47 -to 0 src_mac
create_bd_pin -dir O -from 31 -to 0 dst_ip
create_bd_pin -dir O -from 47 -to 0 dst_mac
create_bd_pin -dir O -from 7 -to 0 -type data Q_data_byte
create_bd_pin -dir O -from 31 -to 0 -type data Q_packet_count
create_bd_pin -dir I s_axi_aclk99
create_bd_pin -dir I -from 255 -to 0 dina

create_bd_cell -type ip -vlnv xilinx.com:ip:xlconstant:1.1 w_max_count
set_property -dict {CONFIG.CONST_VAL 512 CONFIG.CONST_WIDTH 10} [get_bd_cells w_max_count]
create_bd_cell -type ip -vlnv xilinx.com:ip:blk_mem_gen:8.4 blk_mem_gen_0
set_property -dict [list \
  CONFIG.Enable_32bit_Address false \
  CONFIG.Enable_B Use_ENB_Pin \
  CONFIG.Memory_Type Simple_Dual_Port_RAM \
  CONFIG.Operating_Mode_A NO_CHANGE \
  CONFIG.Port_B_Clock 100 \
  CONFIG.Port_B_Enable_Rate 100 \
  CONFIG.Read_Width_B 256 \
  CONFIG.Register_PortB_Output_of_Memory_Primitives true \
  CONFIG.Use_Byte_Write_Enable false \
  CONFIG.Write_Depth_A 1024 \
  CONFIG.Write_Width_A 256 \
  CONFIG.Write_Width_B 256 \
  CONFIG.use_bram_block Stand_Alone \
] [get_bd_cells blk_mem_gen_0]
create_bd_cell -type ip -vlnv xilinx.com:ip:xlconstant:1.1 r_max_count
set_property -dict {CONFIG.CONST_VAL 16383 CONFIG.CONST_WIDTH 15} [get_bd_cells r_max_count]
create_bd_cell -type ip -vlnv xilinx.com:ip:c_shift_ram:12.0 c_shift_ram_0
set_property -dict [list \
  CONFIG.AsyncInitVal 00000000 \
  CONFIG.DefaultData 00000000 \
  CONFIG.Depth 42 \
  CONFIG.Width 8 \
] [get_bd_cells c_shift_ram_0]
create_bd_cell -type ip -vlnv xilinx.com:ip:c_accum:12.0 c_accum_0
set_property -dict [list \
  CONFIG.Bypass false \
  CONFIG.Input_Type Unsigned \
  CONFIG.Input_Width 1 \
  CONFIG.Output_Width 32 \
] [get_bd_cells c_accum_0]
create_bd_cell -type ip -vlnv user.org:user:eth_regs:1.0 eth_regs_0
create_bd_cell -type module -reference eth_buffer eth_buffer_0

# ---- hierarchy /ethWrapPort3 ----
current_bd_instance /ethWrapPort3
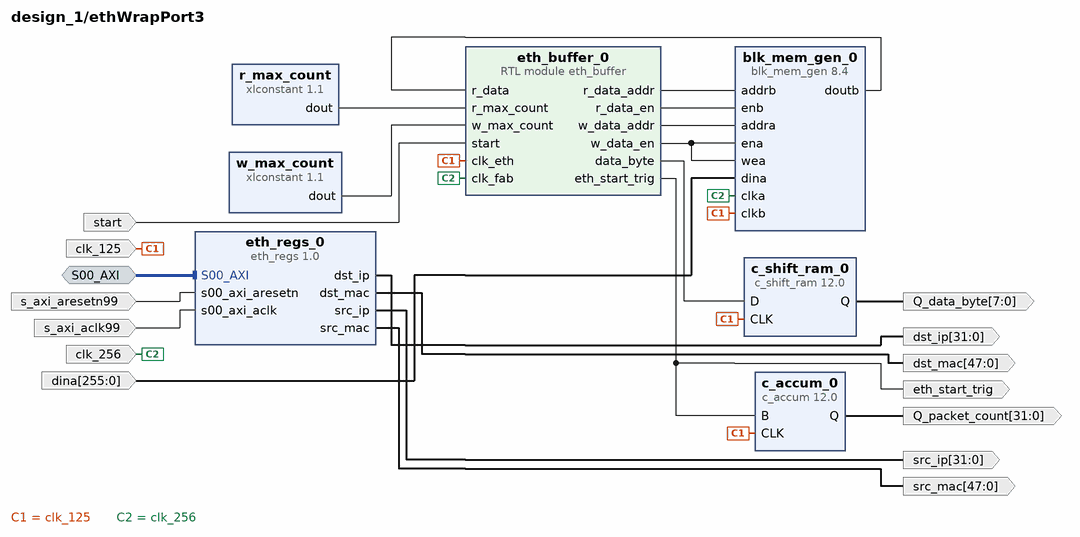
[diagram p30: block diagram inside /ethWrapPort3]
create_bd_intf_pin -mode Slave -vlnv xilinx.com:interface:aximm_rtl:1.0 S00_AXI
create_bd_pin -dir I start
create_bd_pin -dir I -type clk clk_256
create_bd_pin -dir I -type clk clk_125
create_bd_pin -dir I -type rst s_axi_aresetn99
create_bd_pin -dir O eth_start_trig
create_bd_pin -dir O -from 31 -to 0 src_ip
create_bd_pin -dir O -from 47 -to 0 src_mac
create_bd_pin -dir O -from 31 -to 0 dst_ip
create_bd_pin -dir O -from 47 -to 0 dst_mac
create_bd_pin -dir O -from 7 -to 0 -type data Q_data_byte
create_bd_pin -dir O -from 31 -to 0 -type data Q_packet_count
create_bd_pin -dir I s_axi_aclk99
create_bd_pin -dir I -from 255 -to 0 dina

create_bd_cell -type ip -vlnv xilinx.com:ip:xlconstant:1.1 w_max_count
set_property -dict {CONFIG.CONST_VAL 512 CONFIG.CONST_WIDTH 10} [get_bd_cells w_max_count]
create_bd_cell -type ip -vlnv xilinx.com:ip:blk_mem_gen:8.4 blk_mem_gen_0
set_property -dict [list \
  CONFIG.Enable_32bit_Address false \
  CONFIG.Enable_B Use_ENB_Pin \
  CONFIG.Memory_Type Simple_Dual_Port_RAM \
  CONFIG.Operating_Mode_A NO_CHANGE \
  CONFIG.Port_B_Clock 100 \
  CONFIG.Port_B_Enable_Rate 100 \
  CONFIG.Read_Width_B 256 \
  CONFIG.Register_PortB_Output_of_Memory_Primitives true \
  CONFIG.Use_Byte_Write_Enable false \
  CONFIG.Write_Depth_A 1024 \
  CONFIG.Write_Width_A 256 \
  CONFIG.Write_Width_B 256 \
  CONFIG.use_bram_block Stand_Alone \
] [get_bd_cells blk_mem_gen_0]
create_bd_cell -type ip -vlnv xilinx.com:ip:xlconstant:1.1 r_max_count
set_property -dict {CONFIG.CONST_VAL 16383 CONFIG.CONST_WIDTH 15} [get_bd_cells r_max_count]
create_bd_cell -type ip -vlnv xilinx.com:ip:c_shift_ram:12.0 c_shift_ram_0
set_property -dict [list \
  CONFIG.AsyncInitVal 00000000 \
  CONFIG.DefaultData 00000000 \
  CONFIG.Depth 42 \
  CONFIG.Width 8 \
] [get_bd_cells c_shift_ram_0]
create_bd_cell -type ip -vlnv xilinx.com:ip:c_accum:12.0 c_accum_0
set_property -dict [list \
  CONFIG.Bypass false \
  CONFIG.Input_Type Unsigned \
  CONFIG.Input_Width 1 \
  CONFIG.Output_Width 32 \
] [get_bd_cells c_accum_0]
create_bd_cell -type ip -vlnv user.org:user:eth_regs:1.0 eth_regs_0
create_bd_cell -type module -reference eth_buffer eth_buffer_0

# ---- hierarchy /udp_control ----
current_bd_instance /udp_control
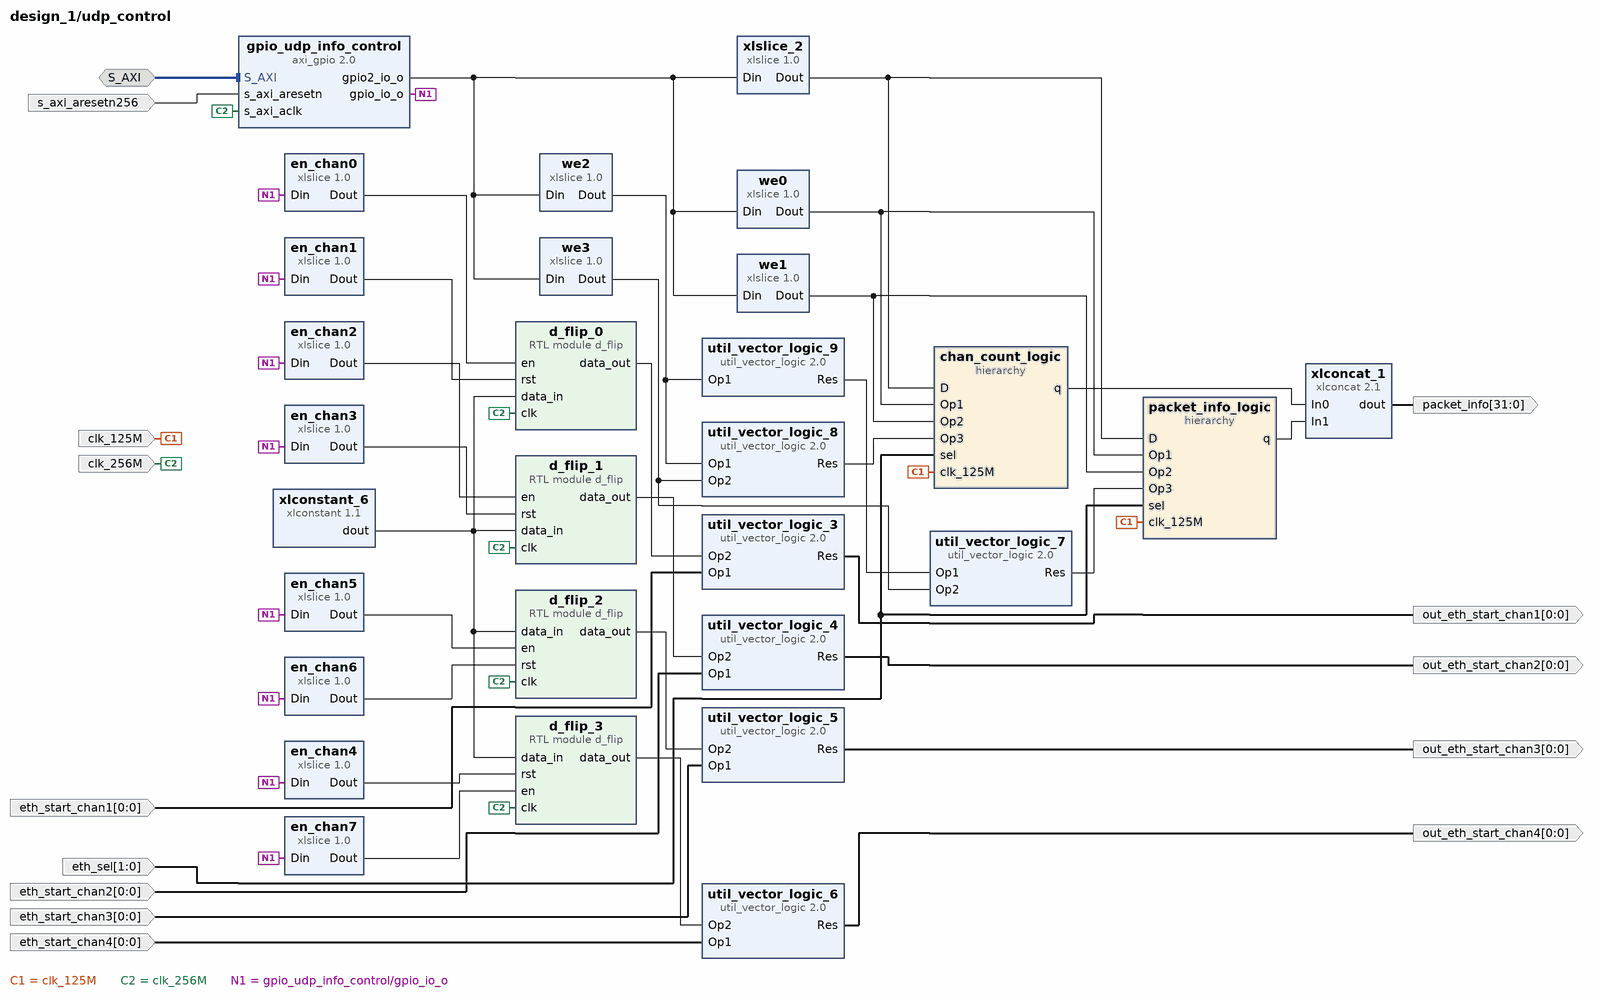
[diagram p31: block diagram inside /udp_control]
create_bd_intf_pin -mode Slave -vlnv xilinx.com:interface:aximm_rtl:1.0 S_AXI
create_bd_pin -dir I -type clk clk_256M
create_bd_pin -dir O -from 31 -to 0 packet_info
create_bd_pin -dir I -from 0 -to 0 eth_start_chan1
create_bd_pin -dir O -from 0 -to 0 out_eth_start_chan1
create_bd_pin -dir I -from 0 -to 0 eth_start_chan2
create_bd_pin -dir O -from 0 -to 0 out_eth_start_chan2
create_bd_pin -dir I -from 0 -to 0 eth_start_chan3
create_bd_pin -dir O -from 0 -to 0 out_eth_start_chan3
create_bd_pin -dir I -type rst s_axi_aresetn256
create_bd_pin -dir I -from 0 -to 0 eth_start_chan4
create_bd_pin -dir O -from 0 -to 0 out_eth_start_chan4
create_bd_pin -dir I -from 1 -to 0 eth_sel
create_bd_pin -dir I -type clk clk_125M

create_bd_cell -type ip -vlnv xilinx.com:ip:xlslice:1.0 en_chan7
set_property -dict {CONFIG.DIN_FROM 6 CONFIG.DIN_TO 6 CONFIG.DOUT_WIDTH 1} [get_bd_cells en_chan7]
create_bd_cell -type ip -vlnv xilinx.com:ip:xlslice:1.0 we1
set_property -dict {CONFIG.DIN_FROM 17 CONFIG.DIN_TO 17 CONFIG.DOUT_WIDTH 1} [get_bd_cells we1]
create_bd_cell -type ip -vlnv xilinx.com:ip:xlslice:1.0 we2
set_property -dict {CONFIG.DIN_FROM 18 CONFIG.DIN_TO 18 CONFIG.DOUT_WIDTH 1} [get_bd_cells we2]
create_bd_cell -type ip -vlnv xilinx.com:ip:xlslice:1.0 we3
set_property -dict {CONFIG.DIN_FROM 19 CONFIG.DIN_TO 19 CONFIG.DOUT_WIDTH 1} [get_bd_cells we3]
create_bd_cell -type ip -vlnv xilinx.com:ip:xlconcat:2.1 xlconcat_1
set_property -dict {CONFIG.IN0_WIDTH 16 CONFIG.IN1_WIDTH 16} [get_bd_cells xlconcat_1]
create_bd_cell -type ip -vlnv xilinx.com:ip:xlslice:1.0 xlslice_2
set_property -dict {CONFIG.DIN_FROM 15 CONFIG.DOUT_WIDTH 16} [get_bd_cells xlslice_2]
create_bd_cell -type ip -vlnv xilinx.com:ip:util_vector_logic:2.0 util_vector_logic_3
set_property -dict {CONFIG.C_OPERATION and CONFIG.C_SIZE 1} [get_bd_cells util_vector_logic_3]
create_bd_cell -type ip -vlnv xilinx.com:ip:xlslice:1.0 en_chan0
set_property -dict {CONFIG.DIN_FROM 0 CONFIG.DOUT_WIDTH 1} [get_bd_cells en_chan0]
create_bd_cell -type ip -vlnv xilinx.com:ip:xlslice:1.0 en_chan1
set_property -dict {CONFIG.DIN_FROM 1 CONFIG.DIN_TO 1 CONFIG.DOUT_WIDTH 1} [get_bd_cells en_chan1]
create_bd_cell -type ip -vlnv xilinx.com:ip:util_vector_logic:2.0 util_vector_logic_4
set_property -dict {CONFIG.C_OPERATION and CONFIG.C_SIZE 1} [get_bd_cells util_vector_logic_4]
create_bd_cell -type ip -vlnv xilinx.com:ip:util_vector_logic:2.0 util_vector_logic_5
set_property -dict {CONFIG.C_OPERATION and CONFIG.C_SIZE 1} [get_bd_cells util_vector_logic_5]
create_bd_cell -type ip -vlnv xilinx.com:ip:xlslice:1.0 en_chan2
set_property -dict {CONFIG.DIN_FROM 2 CONFIG.DIN_TO 2 CONFIG.DOUT_WIDTH 1} [get_bd_cells en_chan2]
create_bd_cell -type ip -vlnv xilinx.com:ip:xlslice:1.0 en_chan3
set_property -dict {CONFIG.DIN_FROM 3 CONFIG.DIN_TO 3 CONFIG.DOUT_WIDTH 1} [get_bd_cells en_chan3]
create_bd_cell -type ip -vlnv xilinx.com:ip:util_vector_logic:2.0 util_vector_logic_7
set_property -dict {CONFIG.C_SIZE 1} [get_bd_cells util_vector_logic_7]
create_bd_cell -type ip -vlnv xilinx.com:ip:xlslice:1.0 en_chan4
set_property -dict {CONFIG.DIN_FROM 7 CONFIG.DIN_TO 7 CONFIG.DOUT_WIDTH 1} [get_bd_cells en_chan4]
create_bd_cell -type ip -vlnv xilinx.com:ip:xlconstant:1.1 xlconstant_6
create_bd_cell -type ip -vlnv xilinx.com:ip:xlslice:1.0 en_chan5
set_property -dict {CONFIG.DIN_FROM 4 CONFIG.DIN_TO 4 CONFIG.DOUT_WIDTH 1} [get_bd_cells en_chan5]
create_bd_cell -type ip -vlnv xilinx.com:ip:util_vector_logic:2.0 util_vector_logic_8
set_property -dict {CONFIG.C_SIZE 1} [get_bd_cells util_vector_logic_8]
create_bd_cell -type ip -vlnv xilinx.com:ip:util_vector_logic:2.0 util_vector_logic_9
set_property -dict {CONFIG.C_OPERATION not CONFIG.C_SIZE 1} [get_bd_cells util_vector_logic_9]
create_bd_cell -type ip -vlnv xilinx.com:ip:axi_gpio:2.0 gpio_udp_info_control
set_property -dict {CONFIG.C_ALL_OUTPUTS 1 CONFIG.C_ALL_OUTPUTS_2 1 CONFIG.C_IS_DUAL 1} [get_bd_cells gpio_udp_info_control]
create_bd_cell -type ip -vlnv xilinx.com:ip:xlslice:1.0 en_chan6
set_property -dict {CONFIG.DIN_FROM 5 CONFIG.DIN_TO 5 CONFIG.DOUT_WIDTH 1} [get_bd_cells en_chan6]
create_bd_cell -type ip -vlnv xilinx.com:ip:util_vector_logic:2.0 util_vector_logic_6
set_property -dict {CONFIG.C_OPERATION and CONFIG.C_SIZE 1} [get_bd_cells util_vector_logic_6]
create_bd_cell -type hier chan_count_logic
create_bd_cell -type hier packet_info_logic
create_bd_cell -type ip -vlnv xilinx.com:ip:xlslice:1.0 we0
set_property -dict {CONFIG.DIN_FROM 16 CONFIG.DIN_TO 16 CONFIG.DOUT_WIDTH 1} [get_bd_cells we0]
create_bd_cell -type module -reference d_flip d_flip_0
set_property -dict {CONFIG.width 1} [get_bd_cells d_flip_0]
create_bd_cell -type module -reference d_flip d_flip_1
set_property -dict {CONFIG.width 1} [get_bd_cells d_flip_1]
create_bd_cell -type module -reference d_flip d_flip_2
set_property -dict {CONFIG.width 1} [get_bd_cells d_flip_2]
create_bd_cell -type module -reference d_flip d_flip_3
set_property -dict {CONFIG.width 1} [get_bd_cells d_flip_3]

# ---- hierarchy /udp_control/chan_count_logic ----
current_bd_instance /udp_control/chan_count_logic
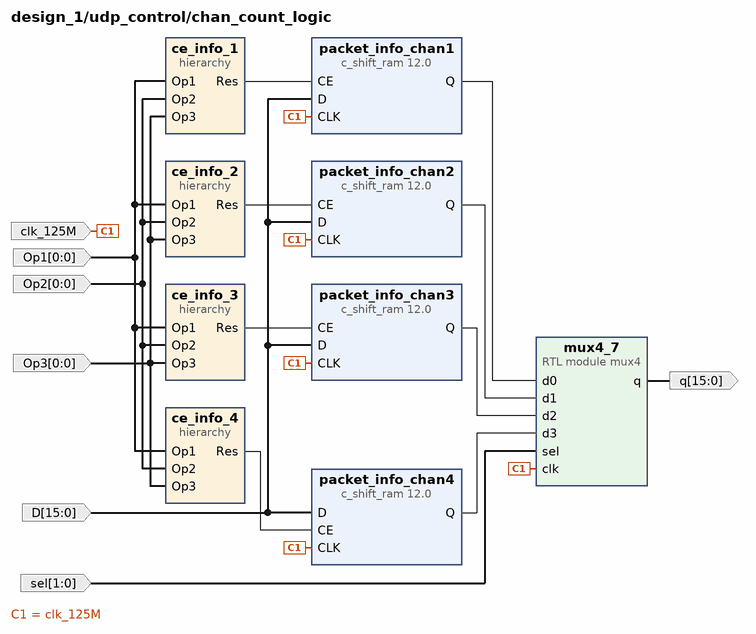
[diagram p32: block diagram inside /udp_control/chan_count_logic]
create_bd_pin -dir I -from 15 -to 0 -type data D
create_bd_pin -dir O -from 15 -to 0 q
create_bd_pin -dir I -from 0 -to 0 Op1
create_bd_pin -dir I -from 0 -to 0 Op2
create_bd_pin -dir I -from 0 -to 0 Op3
create_bd_pin -dir I -from 1 -to 0 sel
create_bd_pin -dir I -type clk clk_125M

create_bd_cell -type ip -vlnv xilinx.com:ip:c_shift_ram:12.0 packet_info_chan1
set_property -dict {CONFIG.CE true CONFIG.Depth 1} [get_bd_cells packet_info_chan1]
create_bd_cell -type ip -vlnv xilinx.com:ip:c_shift_ram:12.0 packet_info_chan2
set_property -dict {CONFIG.CE true CONFIG.Depth 1} [get_bd_cells packet_info_chan2]
create_bd_cell -type ip -vlnv xilinx.com:ip:c_shift_ram:12.0 packet_info_chan3
set_property -dict {CONFIG.CE true CONFIG.Depth 1} [get_bd_cells packet_info_chan3]
create_bd_cell -type ip -vlnv xilinx.com:ip:c_shift_ram:12.0 packet_info_chan4
set_property -dict {CONFIG.CE true CONFIG.Depth 1} [get_bd_cells packet_info_chan4]
create_bd_cell -type hier ce_info_1
create_bd_cell -type hier ce_info_2
create_bd_cell -type hier ce_info_3
create_bd_cell -type hier ce_info_4
create_bd_cell -type module -reference mux4 mux4_7
set_property -dict {CONFIG.width 16} [get_bd_cells mux4_7]

# ---- hierarchy /udp_control/chan_count_logic/ce_info_1 ----
current_bd_instance /udp_control/chan_count_logic/ce_info_1
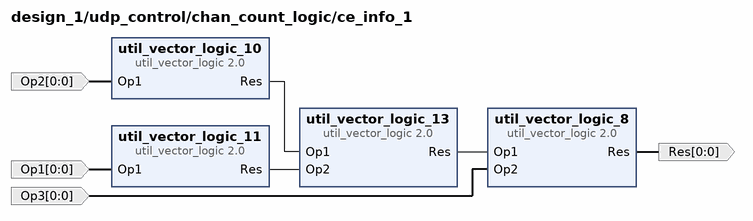
[diagram p33: block diagram inside /udp_control/chan_count_logic/ce_info_1]
create_bd_pin -dir O -from 0 -to 0 Res
create_bd_pin -dir I -from 0 -to 0 Op1
create_bd_pin -dir I -from 0 -to 0 Op2
create_bd_pin -dir I -from 0 -to 0 Op3

create_bd_cell -type ip -vlnv xilinx.com:ip:util_vector_logic:2.0 util_vector_logic_13
set_property -dict {CONFIG.C_OPERATION and CONFIG.C_SIZE 1} [get_bd_cells util_vector_logic_13]
create_bd_cell -type ip -vlnv xilinx.com:ip:util_vector_logic:2.0 util_vector_logic_8
set_property -dict {CONFIG.C_OPERATION and CONFIG.C_SIZE 1} [get_bd_cells util_vector_logic_8]
create_bd_cell -type ip -vlnv xilinx.com:ip:util_vector_logic:2.0 util_vector_logic_10
set_property -dict {CONFIG.C_OPERATION not CONFIG.C_SIZE 1} [get_bd_cells util_vector_logic_10]
create_bd_cell -type ip -vlnv xilinx.com:ip:util_vector_logic:2.0 util_vector_logic_11
set_property -dict {CONFIG.C_OPERATION not CONFIG.C_SIZE 1} [get_bd_cells util_vector_logic_11]

# ---- hierarchy /udp_control/chan_count_logic/ce_info_2 ----
current_bd_instance /udp_control/chan_count_logic/ce_info_2
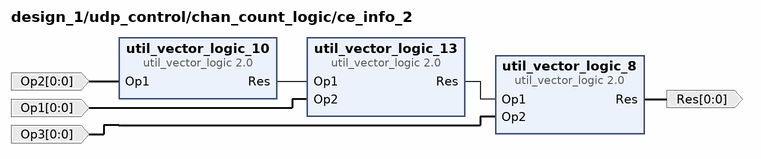
[diagram p34: block diagram inside /udp_control/chan_count_logic/ce_info_2]
create_bd_pin -dir O -from 0 -to 0 Res
create_bd_pin -dir I -from 0 -to 0 Op1
create_bd_pin -dir I -from 0 -to 0 Op2
create_bd_pin -dir I -from 0 -to 0 Op3

create_bd_cell -type ip -vlnv xilinx.com:ip:util_vector_logic:2.0 util_vector_logic_13
set_property -dict {CONFIG.C_OPERATION and CONFIG.C_SIZE 1} [get_bd_cells util_vector_logic_13]
create_bd_cell -type ip -vlnv xilinx.com:ip:util_vector_logic:2.0 util_vector_logic_8
set_property -dict {CONFIG.C_OPERATION and CONFIG.C_SIZE 1} [get_bd_cells util_vector_logic_8]
create_bd_cell -type ip -vlnv xilinx.com:ip:util_vector_logic:2.0 util_vector_logic_10
set_property -dict {CONFIG.C_OPERATION not CONFIG.C_SIZE 1} [get_bd_cells util_vector_logic_10]

# ---- hierarchy /udp_control/chan_count_logic/ce_info_3 ----
current_bd_instance /udp_control/chan_count_logic/ce_info_3
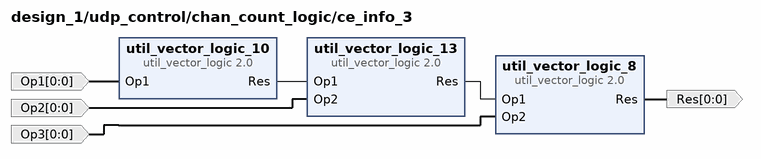
[diagram p35: block diagram inside /udp_control/chan_count_logic/ce_info_3]
create_bd_pin -dir O -from 0 -to 0 Res
create_bd_pin -dir I -from 0 -to 0 Op1
create_bd_pin -dir I -from 0 -to 0 Op2
create_bd_pin -dir I -from 0 -to 0 Op3

create_bd_cell -type ip -vlnv xilinx.com:ip:util_vector_logic:2.0 util_vector_logic_13
set_property -dict {CONFIG.C_OPERATION and CONFIG.C_SIZE 1} [get_bd_cells util_vector_logic_13]
create_bd_cell -type ip -vlnv xilinx.com:ip:util_vector_logic:2.0 util_vector_logic_8
set_property -dict {CONFIG.C_OPERATION and CONFIG.C_SIZE 1} [get_bd_cells util_vector_logic_8]
create_bd_cell -type ip -vlnv xilinx.com:ip:util_vector_logic:2.0 util_vector_logic_10
set_property -dict {CONFIG.C_OPERATION not CONFIG.C_SIZE 1} [get_bd_cells util_vector_logic_10]

# ---- hierarchy /udp_control/chan_count_logic/ce_info_4 ----
current_bd_instance /udp_control/chan_count_logic/ce_info_4
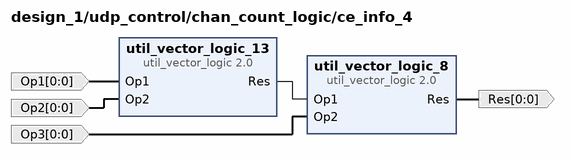
[diagram p36: block diagram inside /udp_control/chan_count_logic/ce_info_4]
create_bd_pin -dir O -from 0 -to 0 Res
create_bd_pin -dir I -from 0 -to 0 Op1
create_bd_pin -dir I -from 0 -to 0 Op2
create_bd_pin -dir I -from 0 -to 0 Op3

create_bd_cell -type ip -vlnv xilinx.com:ip:util_vector_logic:2.0 util_vector_logic_13
set_property -dict {CONFIG.C_OPERATION and CONFIG.C_SIZE 1} [get_bd_cells util_vector_logic_13]
create_bd_cell -type ip -vlnv xilinx.com:ip:util_vector_logic:2.0 util_vector_logic_8
set_property -dict {CONFIG.C_OPERATION and CONFIG.C_SIZE 1} [get_bd_cells util_vector_logic_8]

# ---- hierarchy /udp_control/packet_info_logic ----
current_bd_instance /udp_control/packet_info_logic
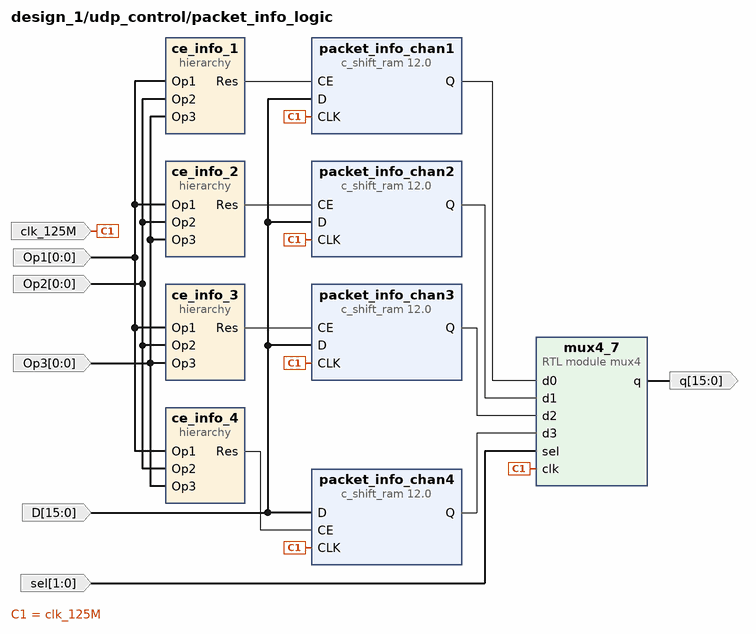
[diagram p37: block diagram inside /udp_control/packet_info_logic]
create_bd_pin -dir I -from 15 -to 0 -type data D
create_bd_pin -dir O -from 15 -to 0 q
create_bd_pin -dir I -from 0 -to 0 Op1
create_bd_pin -dir I -from 0 -to 0 Op2
create_bd_pin -dir I -from 0 -to 0 Op3
create_bd_pin -dir I -from 1 -to 0 sel
create_bd_pin -dir I -type clk clk_125M

create_bd_cell -type ip -vlnv xilinx.com:ip:c_shift_ram:12.0 packet_info_chan1
set_property -dict {CONFIG.CE true CONFIG.Depth 1} [get_bd_cells packet_info_chan1]
create_bd_cell -type ip -vlnv xilinx.com:ip:c_shift_ram:12.0 packet_info_chan2
set_property -dict {CONFIG.CE true CONFIG.Depth 1} [get_bd_cells packet_info_chan2]
create_bd_cell -type ip -vlnv xilinx.com:ip:c_shift_ram:12.0 packet_info_chan3
set_property -dict {CONFIG.CE true CONFIG.Depth 1} [get_bd_cells packet_info_chan3]
create_bd_cell -type ip -vlnv xilinx.com:ip:c_shift_ram:12.0 packet_info_chan4
set_property -dict {CONFIG.CE true CONFIG.Depth 1} [get_bd_cells packet_info_chan4]
create_bd_cell -type hier ce_info_1
create_bd_cell -type hier ce_info_2
create_bd_cell -type hier ce_info_3
create_bd_cell -type hier ce_info_4
create_bd_cell -type module -reference mux4 mux4_7
set_property -dict {CONFIG.width 16} [get_bd_cells mux4_7]

# ---- hierarchy /udp_control/packet_info_logic/ce_info_1 ----
current_bd_instance /udp_control/packet_info_logic/ce_info_1
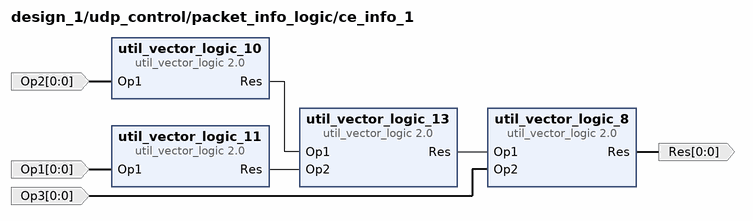
[diagram p38: block diagram inside /udp_control/packet_info_logic/ce_info_1]
create_bd_pin -dir O -from 0 -to 0 Res
create_bd_pin -dir I -from 0 -to 0 Op1
create_bd_pin -dir I -from 0 -to 0 Op2
create_bd_pin -dir I -from 0 -to 0 Op3

create_bd_cell -type ip -vlnv xilinx.com:ip:util_vector_logic:2.0 util_vector_logic_13
set_property -dict {CONFIG.C_OPERATION and CONFIG.C_SIZE 1} [get_bd_cells util_vector_logic_13]
create_bd_cell -type ip -vlnv xilinx.com:ip:util_vector_logic:2.0 util_vector_logic_8
set_property -dict {CONFIG.C_OPERATION and CONFIG.C_SIZE 1} [get_bd_cells util_vector_logic_8]
create_bd_cell -type ip -vlnv xilinx.com:ip:util_vector_logic:2.0 util_vector_logic_10
set_property -dict {CONFIG.C_OPERATION not CONFIG.C_SIZE 1} [get_bd_cells util_vector_logic_10]
create_bd_cell -type ip -vlnv xilinx.com:ip:util_vector_logic:2.0 util_vector_logic_11
set_property -dict {CONFIG.C_OPERATION not CONFIG.C_SIZE 1} [get_bd_cells util_vector_logic_11]

# ---- hierarchy /udp_control/packet_info_logic/ce_info_2 ----
current_bd_instance /udp_control/packet_info_logic/ce_info_2
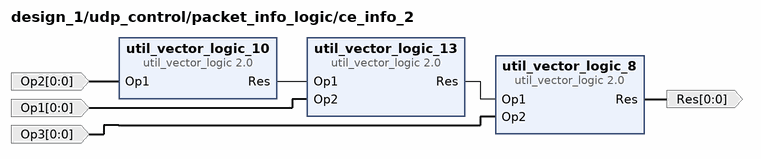
[diagram p39: block diagram inside /udp_control/packet_info_logic/ce_info_2]
create_bd_pin -dir O -from 0 -to 0 Res
create_bd_pin -dir I -from 0 -to 0 Op1
create_bd_pin -dir I -from 0 -to 0 Op2
create_bd_pin -dir I -from 0 -to 0 Op3

create_bd_cell -type ip -vlnv xilinx.com:ip:util_vector_logic:2.0 util_vector_logic_13
set_property -dict {CONFIG.C_OPERATION and CONFIG.C_SIZE 1} [get_bd_cells util_vector_logic_13]
create_bd_cell -type ip -vlnv xilinx.com:ip:util_vector_logic:2.0 util_vector_logic_8
set_property -dict {CONFIG.C_OPERATION and CONFIG.C_SIZE 1} [get_bd_cells util_vector_logic_8]
create_bd_cell -type ip -vlnv xilinx.com:ip:util_vector_logic:2.0 util_vector_logic_10
set_property -dict {CONFIG.C_OPERATION not CONFIG.C_SIZE 1} [get_bd_cells util_vector_logic_10]

# ---- hierarchy /udp_control/packet_info_logic/ce_info_3 ----
current_bd_instance /udp_control/packet_info_logic/ce_info_3
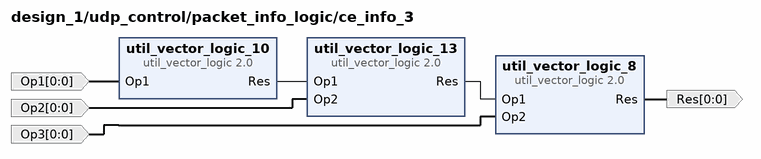
[diagram p40: block diagram inside /udp_control/packet_info_logic/ce_info_3]
create_bd_pin -dir O -from 0 -to 0 Res
create_bd_pin -dir I -from 0 -to 0 Op1
create_bd_pin -dir I -from 0 -to 0 Op2
create_bd_pin -dir I -from 0 -to 0 Op3

create_bd_cell -type ip -vlnv xilinx.com:ip:util_vector_logic:2.0 util_vector_logic_13
set_property -dict {CONFIG.C_OPERATION and CONFIG.C_SIZE 1} [get_bd_cells util_vector_logic_13]
create_bd_cell -type ip -vlnv xilinx.com:ip:util_vector_logic:2.0 util_vector_logic_8
set_property -dict {CONFIG.C_OPERATION and CONFIG.C_SIZE 1} [get_bd_cells util_vector_logic_8]
create_bd_cell -type ip -vlnv xilinx.com:ip:util_vector_logic:2.0 util_vector_logic_10
set_property -dict {CONFIG.C_OPERATION not CONFIG.C_SIZE 1} [get_bd_cells util_vector_logic_10]

# ---- hierarchy /udp_control/packet_info_logic/ce_info_4 ----
current_bd_instance /udp_control/packet_info_logic/ce_info_4
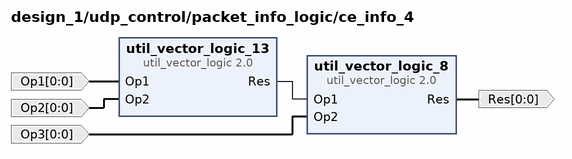
[diagram p41: block diagram inside /udp_control/packet_info_logic/ce_info_4]
create_bd_pin -dir O -from 0 -to 0 Res
create_bd_pin -dir I -from 0 -to 0 Op1
create_bd_pin -dir I -from 0 -to 0 Op2
create_bd_pin -dir I -from 0 -to 0 Op3

create_bd_cell -type ip -vlnv xilinx.com:ip:util_vector_logic:2.0 util_vector_logic_13
set_property -dict {CONFIG.C_OPERATION and CONFIG.C_SIZE 1} [get_bd_cells util_vector_logic_13]
create_bd_cell -type ip -vlnv xilinx.com:ip:util_vector_logic:2.0 util_vector_logic_8
set_property -dict {CONFIG.C_OPERATION and CONFIG.C_SIZE 1} [get_bd_cells util_vector_logic_8]

# ---- hierarchy /mapping_ADC_to_chan ----
current_bd_instance /mapping_ADC_to_chan
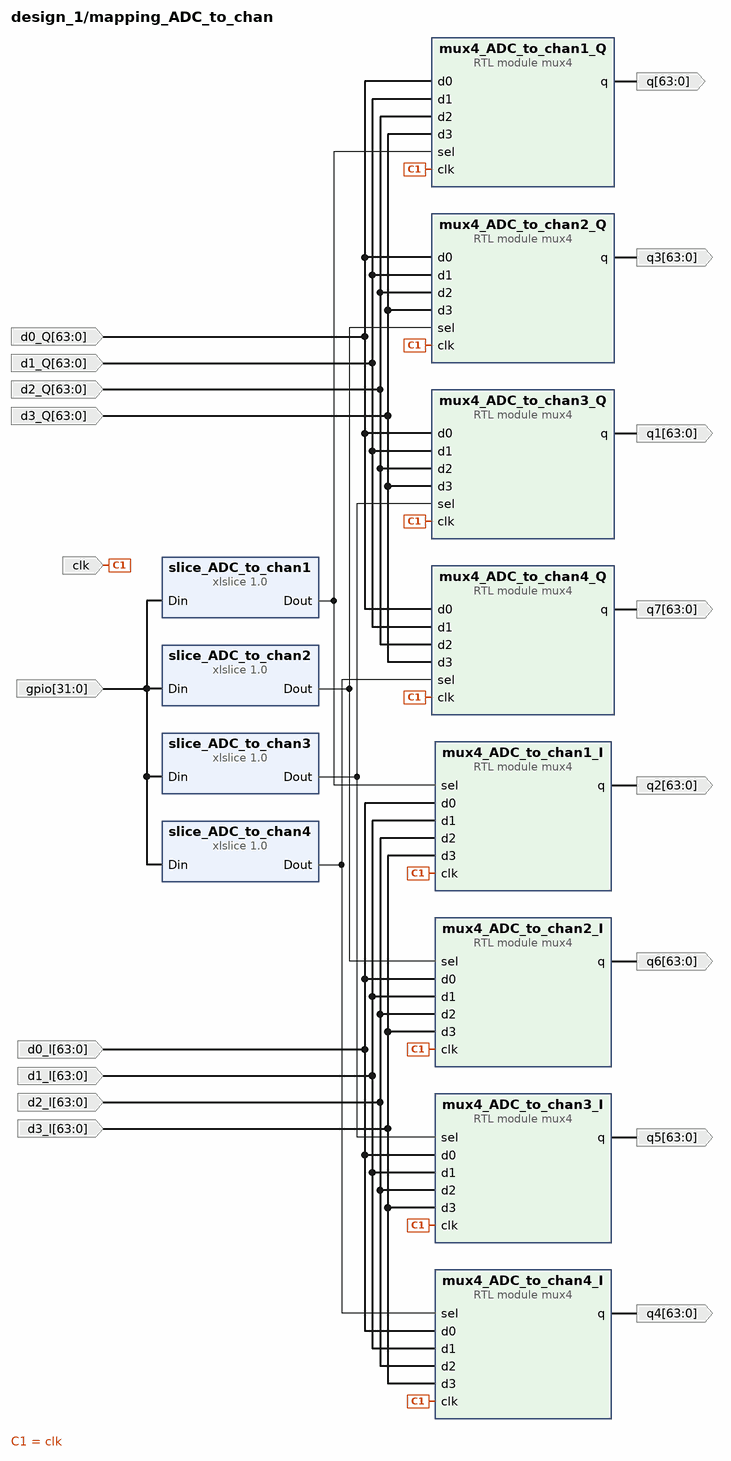
[diagram p42: block diagram inside /mapping_ADC_to_chan]
create_bd_pin -dir I -from 63 -to 0 d0_Q
create_bd_pin -dir I -from 63 -to 0 d1_Q
create_bd_pin -dir I -from 63 -to 0 d2_Q
create_bd_pin -dir I -from 63 -to 0 d3_Q
create_bd_pin -dir I -type clk clk
create_bd_pin -dir O -from 63 -to 0 q
create_bd_pin -dir O -from 63 -to 0 q1
create_bd_pin -dir I -from 63 -to 0 d0_I
create_bd_pin -dir I -from 63 -to 0 d1_I
create_bd_pin -dir I -from 63 -to 0 d2_I
create_bd_pin -dir I -from 63 -to 0 d3_I
create_bd_pin -dir O -from 63 -to 0 q2
create_bd_pin -dir O -from 63 -to 0 q3
create_bd_pin -dir O -from 63 -to 0 q4
create_bd_pin -dir O -from 63 -to 0 q5
create_bd_pin -dir I -from 31 -to 0 gpio
create_bd_pin -dir O -from 63 -to 0 q6
create_bd_pin -dir O -from 63 -to 0 q7

create_bd_cell -type ip -vlnv xilinx.com:ip:xlslice:1.0 slice_ADC_to_chan1
set_property -dict {CONFIG.DIN_FROM 9 CONFIG.DIN_TO 8 CONFIG.DOUT_WIDTH 2} [get_bd_cells slice_ADC_to_chan1]
create_bd_cell -type ip -vlnv xilinx.com:ip:xlslice:1.0 slice_ADC_to_chan2
set_property -dict {CONFIG.DIN_FROM 11 CONFIG.DIN_TO 10 CONFIG.DOUT_WIDTH 2} [get_bd_cells slice_ADC_to_chan2]
create_bd_cell -type ip -vlnv xilinx.com:ip:xlslice:1.0 slice_ADC_to_chan3
set_property -dict {CONFIG.DIN_FROM 13 CONFIG.DIN_TO 12 CONFIG.DOUT_WIDTH 2} [get_bd_cells slice_ADC_to_chan3]
create_bd_cell -type ip -vlnv xilinx.com:ip:xlslice:1.0 slice_ADC_to_chan4
set_property -dict {CONFIG.DIN_FROM 15 CONFIG.DIN_TO 14 CONFIG.DOUT_WIDTH 2} [get_bd_cells slice_ADC_to_chan4]
create_bd_cell -type module -reference mux4 mux4_ADC_to_chan4_Q
set_property -dict {CONFIG.width 64} [get_bd_cells mux4_ADC_to_chan4_Q]
create_bd_cell -type module -reference mux4 mux4_ADC_to_chan3_I
set_property -dict {CONFIG.width 64} [get_bd_cells mux4_ADC_to_chan3_I]
create_bd_cell -type module -reference mux4 mux4_ADC_to_chan3_Q
set_property -dict {CONFIG.width 64} [get_bd_cells mux4_ADC_to_chan3_Q]
create_bd_cell -type module -reference mux4 mux4_ADC_to_chan4_I
set_property -dict {CONFIG.width 64} [get_bd_cells mux4_ADC_to_chan4_I]
create_bd_cell -type module -reference mux4 mux4_ADC_to_chan1_I
set_property -dict {CONFIG.width 64} [get_bd_cells mux4_ADC_to_chan1_I]
create_bd_cell -type module -reference mux4 mux4_ADC_to_chan1_Q
set_property -dict {CONFIG.width 64} [get_bd_cells mux4_ADC_to_chan1_Q]
create_bd_cell -type module -reference mux4 mux4_ADC_to_chan2_I
set_property -dict {CONFIG.width 64} [get_bd_cells mux4_ADC_to_chan2_I]
create_bd_cell -type module -reference mux4 mux4_ADC_to_chan2_Q
set_property -dict {CONFIG.width 64} [get_bd_cells mux4_ADC_to_chan2_Q]
